# Altium schematic sheet AD_Converter.SchDoc
size A3; SheetNumber: 8; SheetTotal: 16
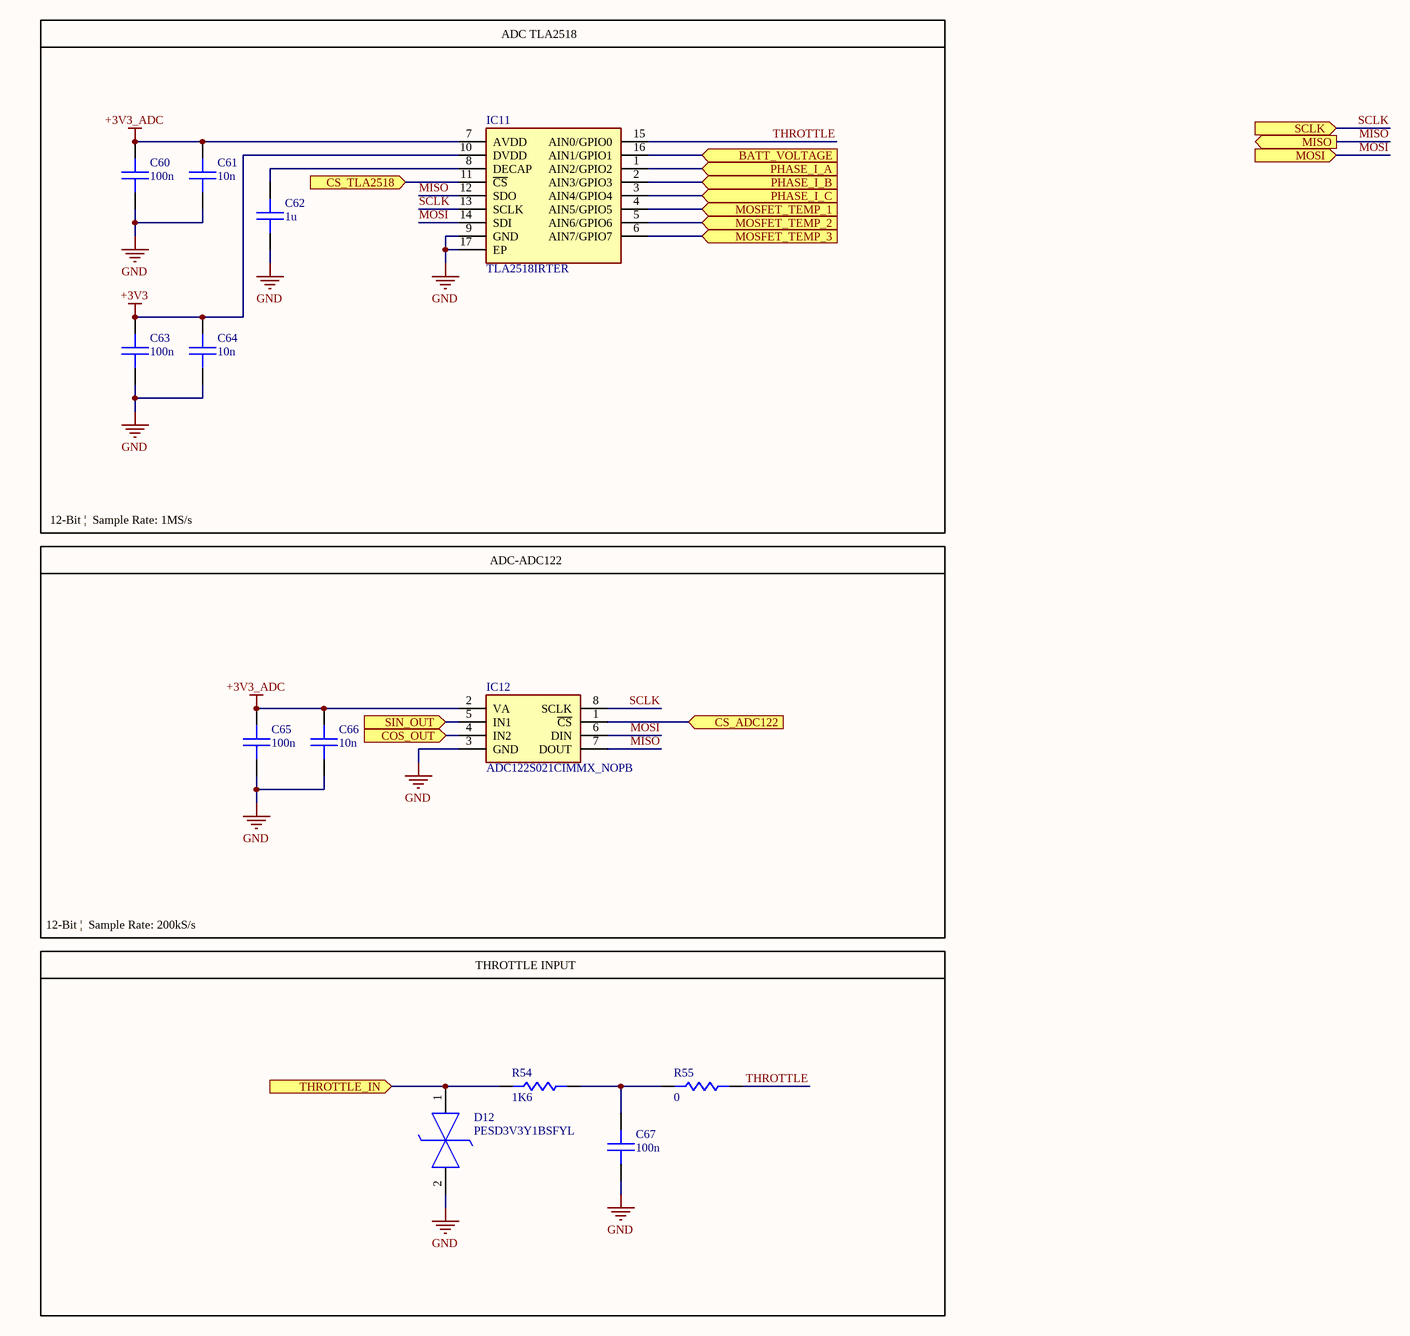
[diagram p0: AD_Converter.SchDoc]

## Parts
C60  100n  [C_0603]
C61  10n  [C_0603]
C62  1u  [C_0603]
C63  100n  [C_0603]
C64  10n  [C_0603]
C65  100n  [C_0603]
C66  10n  [C_0603]
C67  100n  [C_0603]
D12  PESD3V3Y1BSFYL  [PMEG3005AESFYL]
IC11  TLA2518IRTER  [QFN50P300X300X80-17N-D]
IC12  ADC122S021CIMMX_NOPB  [SOP65P490X110-8N]
R54  1K6  [R_0603]
R55  0  [R_0603]

## Blocks framed on the sheet
THROTTLE INPUT: C67 D12 R54 R55

## Ports
BATT_VOLTAGE (in, see Interconnections[2B], Headers[1A]), COS_OUT (in, see Interconnections[3B], Feedback_Sensors[3C]), CS_ADC122 (in, see Interconnections[3B], IO_Expander[3A]), CS_TLA2518 (in, see Interconnections[3B], IO_Expander[3A]), MISO (out, see Interconnections[3C], Isolator_Spi[2A]), MOSFET_TEMP_1 (in, see Interconnections[2C], Headers[1B]), MOSFET_TEMP_2 (in, see Interconnections[2C], Headers[1B]), MOSFET_TEMP_3 (in, see Interconnections[2C], Headers[1B]), MOSI (in, see Interconnections[3C], Isolator_Spi[2A]), PHASE_I_A (in, see Interconnections[2B], Headers[1A]), PHASE_I_B (in, see Interconnections[2C], Headers[1A]), PHASE_I_C (in, see Interconnections[2C], Headers[2A]), SCLK (in, see Interconnections[3C], Isolator_Spi[2A]), SIN_OUT (in, see Interconnections[3B], Feedback_Sensors[3C]), THROTTLE_IN (in, see Interconnections[2B], Main_Connector[1B])

## Nets
+3V3: C63.2 C64.2 IC11.10(DVDD)
+3V3_ADC: C60.2 C61.2 C65.2 C66.2 IC11.7(AVDD) IC12.2(VA)
GND: C60.1 C61.1 C62.1 C63.1 C64.1 C65.1 C66.1 C67.1 D12.2(K2) IC11.9(GND) IC11.17(EP) IC12.3(GND)
BATT_VOLTAGE: IC11.16(AIN1/GPIO1) ; port BATT_VOLTAGE
COS_OUT: IC12.4(IN2) ; port COS_OUT
CS_ADC122: IC12.1(~{CS}) ; port CS_ADC122
CS_TLA2518: IC11.11(~{CS}) ; port CS_TLA2518
MISO: IC11.12(SDO) IC12.7(DOUT) ; port MISO
MOSFET_TEMP_1: IC11.4(AIN5/GPIO5) ; port MOSFET_TEMP_1
MOSFET_TEMP_2: IC11.5(AIN6/GPIO6) ; port MOSFET_TEMP_2
MOSFET_TEMP_3: IC11.6(AIN7/GPIO7) ; port MOSFET_TEMP_3
MOSI: IC11.14(SDI) IC12.6(DIN) ; port MOSI
PHASE_I_A: IC11.1(AIN2/GPIO2) ; port PHASE_I_A
PHASE_I_B: IC11.2(AIN3/GPIO3) ; port PHASE_I_B
PHASE_I_C: IC11.3(AIN4/GPIO4) ; port PHASE_I_C
SCLK: IC11.13(SCLK) IC12.8(SCLK) ; port SCLK
SIN_OUT: IC12.5(IN1) ; port SIN_OUT
THROTTLE: IC11.15(AIN0/GPIO0) R55.1
THROTTLE_IN: D12.1(K1) R54.2 ; port THROTTLE_IN
NetC62_2: C62.2 IC11.8(DECAP)
NetC67_2: C67.2 R54.1 R55.2

## Notes on the sheet
- ADC TLA2518
- 12-Bit |  Sample Rate: 1MS/s
- ADC-ADC122
- 12-Bit |  Sample Rate: 200kS/s

## Library data of the parts
C60-C67 = CAP: SMD Chip Capacitor
D12 = PESD3V3Y1BSFYL: Diode ESD (Bi-directional); Manufacturer_Name: Nexperia; Datasheet Link: https://assets.nexperia.com/documents/data-sheet/PESD3V3Y1BSF.pdf; Manufacturer_Part_Number: PESD3V3Y1BSFYL; Mouser Part Number: 771-PESD3V3Y1BSFYL; Mouser Price/Stock: https://www.mouser.co.uk/ProductDetail/Nexperia/PESD3V3Y1BSFYL?qs=MLItCLRbWswJ%2F2jJIhlIxQ%3D%3D; Arrow Part Number: PESD3V3Y1BSFYL; Arrow Price/Stock: https://www.arrow.com/en/products/pesd3v3y1bsfyl/nexperia?region=asia
IC11 = TLA2518IRTER: Integrated Circuit; Manufacturer_Name: Texas Instruments; Datasheet Link: http://www.ti.com/lit/ds/symlink/tla2518.pdf; Height: 0.8mm; Manufacturer_Part_Number: TLA2518IRTER; Mouser Part Number: 595-TLA2518IRTER; Mouser Price/Stock: https://www.mouser.co.uk/ProductDetail/Texas-Instruments/TLA2518IRTER?qs=XeJtXLiO41Rx1uJi657ctQ%3D%3D; Arrow Part Number: TLA2518IRTER; Arrow Price/Stock: https://www.arrow.com/en/products/tla2518irter/texas-instruments?region=europe
IC12 = ADC122S021CIMMX_NOPB: Integrated Circuit; Manufacturer_Name: Texas Instruments; Manufacturer_Part_Number: ADC122S021CIMMX/NOPB; Datasheet Link: http://www.ti.com/lit/gpn/ADC122S021; Height: 1.1mm; Mouser Part Number: 926-A122S021CIMMXNPB; Mouser Price/Stock: https://www.mouser.co.uk/ProductDetail/Texas-Instruments/ADC122S021CIMMX-NOPB/?qs=7X5t%252BdzoRHB2bC7Teu8H3A%3D%3D; Arrow Part Number: ADC122S021CIMMX/NOPB; Arrow Price/Stock: https://www.arrow.com/en/products/adc122s021cimmxnopb/texas-instruments
R54 R55 = RES: SMD Chip Resistor